# EasyEDA schematic SCH_Power_board_2023-06-05.json
TITLE: Sheet_1; REV: 1.0; Date: 2023-03-13; Sheet: 1/1; Drawn By: zlz9sq; Company: Your Company
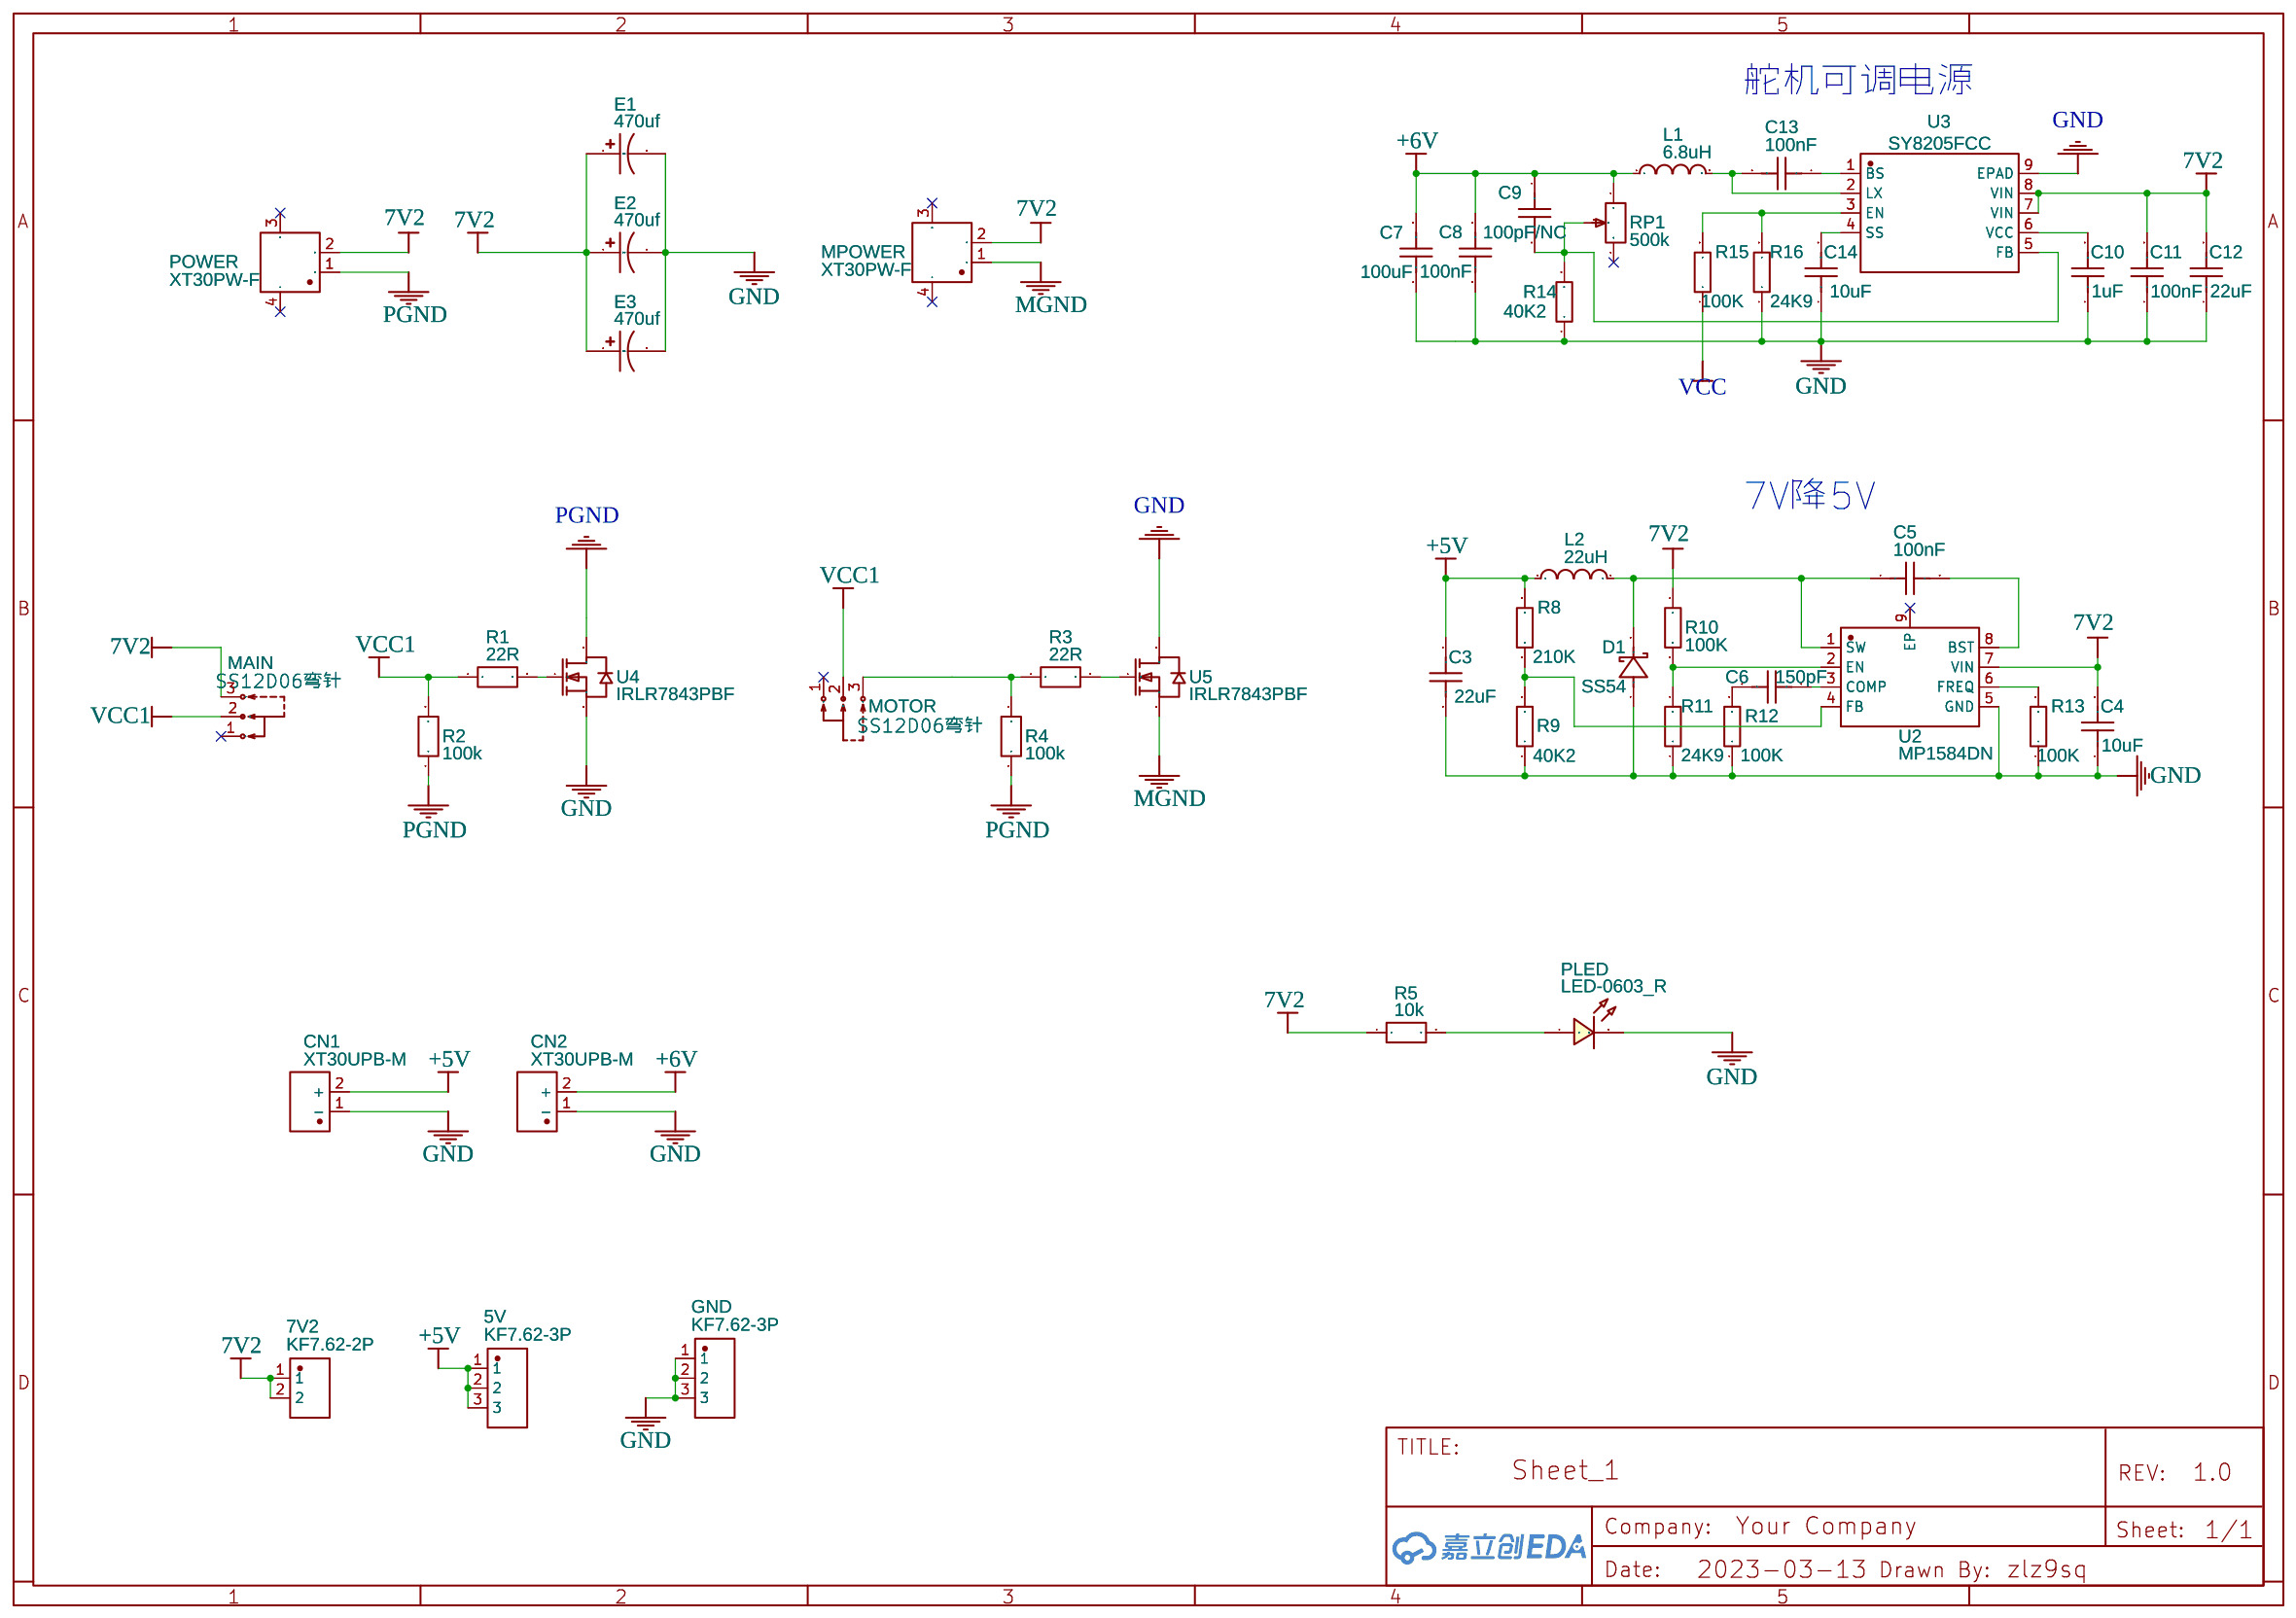
[diagram p0: schematic sheet]

## Parts
5V  KF7.62-3P  [CONN-TH_KF7.62-3P]
7V2  KF7.62-2P  [CONN-TH_KF7.62-2P]
C3  22uF  [C0603]
C4  10uF  [C0603]
C5  100nF  [C0603]
C6  150pF  [C0603]
C7  100uF  [C1210]
C8  100nF  [C0603]
C9  100pF/NC  [C0603]
C10  1uF  [C0603]
C11  100nF  [C0603]
C12  22uF  [C0603]
C13  100nF  [C0603]
C14  10uF  [C0603]
CN1  XT30UPB-M  [CONN-TH_XT30UPB-M]
CN2  XT30UPB-M  [CONN-TH_XT30UPB-M]
D1  SS54  [SMA_L4.6-W2.6-LS5.1-R-RD]
E1  470uf  [CAP-D5.0×F2.0]
E2  470uf  [CAP-D5.0×F2.0]
E3  470uf  [CAP-D5.0×F2.0]
GND  KF7.62-3P  [CONN-TH_KF7.62-3P]
L1  6.8uH  [IND-SMD_L7.0-W6.6_FXL0630]
L2  22uH  [IND-SMD_L7.0-W6.6_FXL0630]
MAIN  SS12D06弯针  [SW-TH_3P-SS12D06-1]
MOTOR  SS12D06弯针  [SW-TH_3P-SS12D06-1]
MPOWER  XT30PW-F  [CONN-TH_XT30PW-F]
PLED  LED-0603_R  [LED0603_RED]
POWER  XT30PW-F  [CONN-TH_XT30PW-F]
R1  22R  [R0603]
R2  100k  [R0603]
R3  22R  [R0603]
R4  100k  [R0603]
R5  10k  [R0603]
R8  210K  [R0603]
R9  40K2  [R0603]
R10  100K  [R0603]
R11  24K9  [R0603]
R12  100K  [R0603]
R13  100K  [R0603]
R14  40K2  [R0603]
R15  100K  [R0603]
R16  24K9  [R0603]
RP1  500k  [RES-ADJ-TH_3296W]
U2  MP1584DN  [SOIC-8_L4.9-W3.9-P1.27-LS6.0-BL-EP3.4]
U3  SY8205FCC  [SOIC-8_L5.0-W4.0-P1.27-LS6.0-BL-EP2.0]
U4  IRLR7843PBF  [TO-252-2_L6.5-W6.1-P4.58-LS10.0-BL]
U5  IRLR7843PBF  [TO-252-2_L6.5-W6.1-P4.58-LS10.0-BL]

## Library data of the parts
5V GND = KF7.62-3P: Supplier: LCSC; Supplier Part: C707825; Manufacturer: KEFA(科发); Contributor: LCSC; JLCPCB Part Class: Extended Part
7V2 = KF7.62-2P: Supplier: LCSC; Supplier Part: C707824; Manufacturer: KEFA(科发); Contributor: LCSC; JLCPCB Part Class: Extended Part
C3-C6 C8-C14 = C_0603_US: Contributor: LCEDA_Lib; Package Display: No
C7 = C1210X7R475K630NT: Supplier: LCSC; Supplier Part: C2911397; Manufacturer: SANYEAR(叁叶源); Contributor: lcsc; Package Display: No
CN1 CN2 = XT30UPB-M: Supplier: LCSC; Supplier Part: C428721; Manufacturer: AMASS(艾迈斯); Contributor: LCSC; JLCPCB Part Class: Extended Part
D1 = SS54G: Supplier: LCSC; Supplier Part: C719150; Manufacturer: SHIKUES(时科); Contributor: LCSC; JLCPCB Part Class: Extended Part; Package Display: No
E1-E3 = CE_TH_D5.0×F2.0_US: Contributor: LCEDA_Lib
L1 L2 = FXL0630-8R2-M: Supplier: LCSC; Manufacturer: cjiang(长江微电); Contributor: LCSC; Supplier Part: C167222; JLCPCB Part Class: Extended Part; Package Display: No
MAIN MOTOR = SS12D06弯针: Supplier: LCSC; Supplier Part: C9900027365; Manufacturer: null; JLCPCB Part Class: Extended Part; Contributor: lcsc
MPOWER POWER = XT30PW-F: Supplier: LCSC; Supplier Part: C2913282; Manufacturer: null; JLCPCB Part Class: Extended Part; Contributor: LCSC
PLED = LED-0603_R: Manufacturer: EVERLIGHT(台湾亿光); Manufacturer Part: 19-217/R6C-AL1M2VY/3T; Supplier Part: C72044; Supplier: LCSC; Contributor: LCEDA_01
R1-R5 = R_0603_EU: Contributor: LCEDA_Lib
R8-R16 = QR0603B47KP05: Supplier: LCSC; Supplier Part: C176123; Manufacturer: Ever Ohms Tech; Contributor: ph1578389306; JLCPCB Part Class: Extended Part; Package Display: No
RP1 = 多圈电位器3296W顶调20K: Supplier: LCSC; Supplier Part: C9900006166; Manufacturer: null; JLCPCB Part Class: Extended Part; Contributor: LCSC; Package Display: No
U2 = MP1584DN: Supplier: LCSC; Supplier Part: C9900012540; Manufacturer: null; JLCPCB Part Class: Extended Part; Contributor: LCSC; Package Display: No
U3 = SY8205FCC: Supplier: LCSC; Supplier Part: C111875; Manufacturer: silergy(矽力杰); Contributor: LCSC; JLCPCB Part Class: Extended Part; Package Display: No
U4 U5 = IRLR7843PBF: Supplier: LCSC; Supplier Part: C3294487; Manufacturer: null; JLCPCB Part Class: Extended Part; Contributor: lcsc

## Nets
7V2: 7V2.1 7V2.2 C4.2 C11.2 C12.2 E1.1 E2.1 E3.1 MAIN.3 MPOWER.2 POWER.2 R5.1 R10.1 U2.7(VIN) U3.7(VIN) U3.8(VIN)
+5V: 5V.1 5V.2 5V.3 C3.1 CN1.2(+) L2.1 R8.2
+6V: C7.2 C8.1 C9.1 CN2.2(+) L1.1 RP1.1
GND: C3.2 C4.1 C7.1 C8.2 C10.1 C11.1 C12.1 C14.1 CN1.1(-) CN2.1(-) D1.1(A) E1.2 E2.2 E3.2 GND.1 GND.2 GND.3 PLED.2 R9.1 R11.1 R12.1 R13.1 R14.1 R16.1 U2.5(GND) U3.9(EPAD) U4.3(S) U5.2(D)
PGND: POWER.1 R2.1 R4.1 U4.2(D)
VCC: R15.1
VCC1: MAIN.2 MOTOR.2 R1.1 R2.2
MGND: MPOWER.1 U5.3(S)
Net-(C5-1): C5.1 D1.2(K) L2.2 U2.1(SW)
Net-(C5-2): C5.2 U2.8(BST)
Net-(C6-1): C6.1 U2.3(COMP)
Net-(C6-2): C6.2 R12.2
Net-(C9-2): C9.2 R14.2 RP1.2 U3.5(FB)
Net-(C10-2): C10.2 U3.6(VCC)
Net-(C13-1): C13.1 U3.1(BS)
Net-(C13-2): C13.2 L1.2 U3.2(LX)
Net-(C14-2): C14.2 U3.4(SS)
Net-(MOTOR-3): MOTOR.3 R3.1 R4.2
Net-(PLED-1): PLED.1 R5.2
Net-(R1-2): R1.2 U4.1(G)
Net-(R3-2): R3.2 U5.1(G)
Net-(R8-1): R8.1 R9.2 U2.4(FB)
Net-(R10-2): R10.2 R11.2 U2.2(EN)
Net-(R13-2): R13.2 U2.6(FREQ)
Net-(R15-2): R15.2 R16.2 U3.3(EN)

Not connected (* = marked no-connect by the designer): MAIN 1*; MOTOR 1*; MPOWER 3* 4*; POWER 3* 4*; RP1 3*; U2 9(EP)*

## Notes on the sheet
- 舵机可调电源
- 7V降5V
